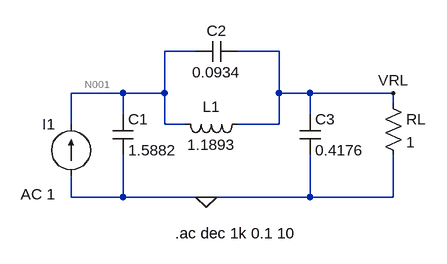
[diagram p0: schematic Punto 2.asc]
Punto 2.asc, the LTspice schematic file:
Version 4
SHEET 1 880 680
WIRE 144 32 96 32
WIRE 272 32 208 32
WIRE 32 96 -48 96
WIRE 96 96 96 32
WIRE 96 96 32 96
WIRE 272 96 272 32
WIRE 320 96 272 96
WIRE 448 96 320 96
WIRE 448 112 448 96
WIRE 32 128 32 96
WIRE 320 128 320 96
WIRE -48 144 -48 96
WIRE 96 144 96 96
WIRE 128 144 96 144
WIRE 272 144 272 96
WIRE 272 144 208 144
WIRE -48 256 -48 224
WIRE 32 256 32 192
WIRE 32 256 -48 256
WIRE 160 256 32 256
WIRE 320 256 320 192
WIRE 320 256 160 256
WIRE 448 256 448 192
WIRE 448 256 320 256
FLAG 160 256 0
FLAG 448 96 VRL
SYMBOL cap 16 128 R0
SYMATTR InstName C1
SYMATTR Value 1.5882
SYMBOL cap 208 16 R90
WINDOW 0 0 32 VBottom 2
WINDOW 3 32 32 VTop 2
SYMATTR InstName C2
SYMATTR Value 0.0934
SYMBOL ind 224 128 R90
WINDOW 0 5 56 VBottom 2
WINDOW 3 32 56 VTop 2
SYMATTR InstName L1
SYMATTR Value 1.1893
SYMBOL cap 304 128 R0
SYMATTR InstName C3
SYMATTR Value 0.4176
SYMBOL current -48 224 R180
WINDOW 0 24 80 Left 2
WINDOW 3 24 0 Left 2
WINDOW 123 24 -28 Left 2
WINDOW 39 0 0 Left 0
SYMATTR InstName I1
SYMATTR Value ""
SYMATTR Value2 AC 1
SYMBOL res 432 96 R0
SYMATTR InstName RL
SYMATTR Value 1
TEXT 112 312 Left 2 !.ac dec 1k 0.1 10

The netlist it stands for:
* Punto 2.asc
C1 N001 0 1.5882
C2 VRL N001 0.0934
L1 VRL N001 1.1893
C3 VRL 0 0.4176
I1 0 N001 AC 1
RL VRL 0 1
.ac dec 1k 0.1 10
.backanno
.end

* Results of the author's LTspice run, read from the files saved beside the schematic
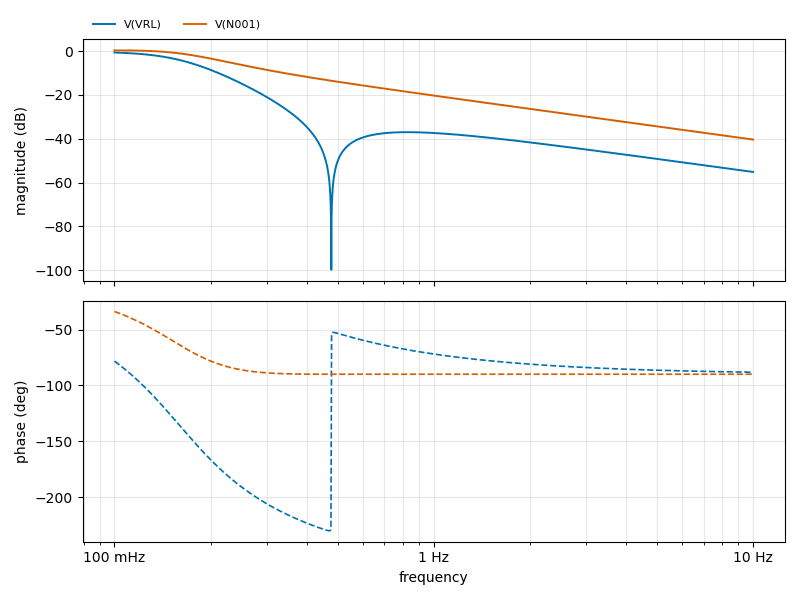
[diagram p1: AC Analysis of Punto 2.asc, plotted from the saved traces]
* AC Analysis, 1 run:
*   V(VRL): -0.66 dB at 100 mHz, -55.17 dB at 10 Hz, peak -0.66 dB at 100 mHz, 3 dB below the peak at 155.4 mHz
*   V(N001): 0.29 dB at 100 mHz, -40.39 dB at 10 Hz, peak 0.29 dB at 100 mHz, 3 dB below the peak at 188.7 mHz